# Altium schematic sheet Communication.SchDoc
size A4; SheetNumber: 2; SheetTotal: 4
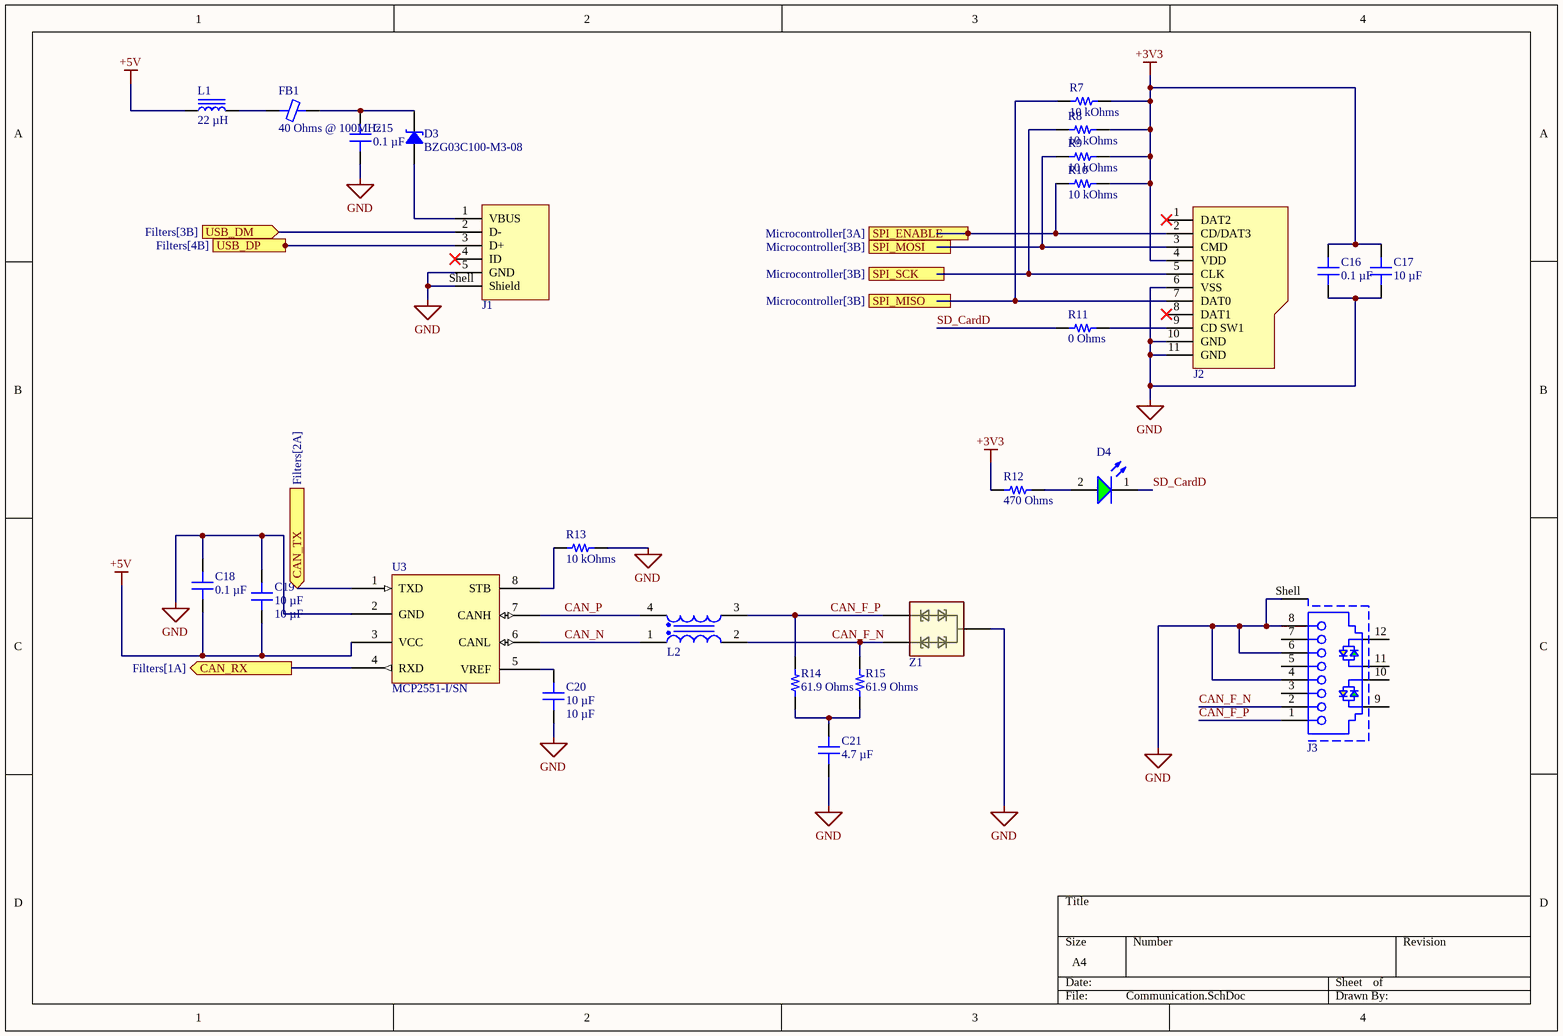
[diagram p0: Communication.SchDoc]

## Parts
C15  0.1 µF  [CAP 0805_2012]
C16  0.1 µF  [CAP 0805_2012]
C17  10 µF  [CAP 0805_2012]
C18  0.1 µF  [CAP 0805_2012]
C19  10 µF  [CAP 0805_2012]
C20  10 µF  [CAP 0805_2012]
C21  4.7 µF  [CAP 0805_2012]
D3  BZG03C100-M3-08  [DO214AC SMA]
D4  Green, 3.2V, 140°  [WL-SMCW_0805_150080xx75000]  (value not drawn)
FB1  40 Ohms @ 100MHz  [FER 0805_2012]
J1  629105150521  [629105150521]  (value not drawn)
J2  693071030811  [693071030811]  (value not drawn)
J3  615008142121  [615008142121]  (value not drawn)
L1  22 µH  [IND 0806_2016]
L2  5000Ohm  [WE-CNSW_1812]  (value not drawn)
R7  10 kOhms  [RES 0805_2012]
R8  10 kOhms  [RES 0805_2012]
R9  10 kOhms  [RES 0805_2012]
R10  10 kOhms  [RES 0805_2012]
R11  0 Ohms  [RES 0805_2012]
R12  470 Ohms  [RES 0805_2012]
R13  10 kOhms  [RES 0805_2012]
R14  61.9 Ohms  [RES 0805_2012]
R15  61.9 Ohms  [RES 0805_2012]
U3  Supplier Part Number 1: MCP2551-I/SN  [MCP2551T-I/SN]  (hidden comment: MCP2551)
Z1  PESD2CAN,215  [SOT95P230X110-3N]  (value not drawn)

## Ports
CAN_RX (out, see Filters[1A]), CAN_TX (in, see Filters[2A]), SPI_ENABLE (in, see Microcontroller[3A]), SPI_MISO (out, see Microcontroller[3B]), SPI_MOSI (in, see Microcontroller[3B]), SPI_SCK (in, see Microcontroller[3B]), USB_DM (in, see Filters[3B]), USB_DP (out, see Filters[4B])

## Nets
+3V3: C16.2 C17.2 J2.4(VDD) R7.2 R8.2 R9.2 R10.2 R12.1
+5V: C18.2 C19.1 L1.1 U3.3(VCC)
GND: C15.1 C16.1 C17.1 C18.1 C19.2 C20.1 C21.1 J1.5(GND) J1.Shell(Shield) J2.6(VSS) J2.10(GND) J2.11(GND) J3.4 J3.6 J3.8 J3.Shell R13.2 U3.2(GND) Z1.3
CAN_F_N: J3.2 L2.2 R15.2 Z1.2
CAN_F_P: J3.1 L2.3 R14.2 Z1.1
CAN_N: L2.1 U3.6(CANL)
CAN_P: L2.4 U3.7(CANH)
CAN_RX: U3.4(RXD) ; port CAN_RX
CAN_TX: U3.1(TXD) ; port CAN_TX
SD_CardD: D4.1(K) R11.1
SPI_ENABLE: J2.2(CD/DAT3) R10.1 ; port SPI_ENABLE
SPI_MISO: J2.7(DAT0) R7.1 ; port SPI_MISO
SPI_MOSI: J2.3(CMD) R9.1 ; port SPI_MOSI
SPI_SCK: J2.5(CLK) R8.1 ; port SPI_SCK
USB_DM: J1.2(D-) ; port USB_DM
USB_DP: J1.3(D+) ; port USB_DP
NetC15_2: C15.2 D3.2 FB1.2
NetC20_2: C20.2 U3.5(VREF)
NetC21_2: C21.2 R14.1 R15.1
NetD3_1: D3.1 J1.1(VBUS)
NetD4_2: D4.2(A) R12.2
NetFB1_1: FB1.1 L1.2
NetJ2_9: J2.9(CD_SW1) R11.2
NetR13_1: R13.1 U3.8(STB)

Not connected (* = marked no-connect by the designer): J1 4(ID)*; J2 1(DAT2)* 8(DAT1)*; J3 3 5 7 9 10 11 12

## Library data of the parts
C15 C16 C18 = CC0805MRX7R9BB104: CAP CER 0.1UF 50V X7R 0805; manufacturer: Yageo; Tolerance: ±20%; Part Number: CC0805MRX7R9BB104; Value: 0.1 µF; Applications: General Purpose; Capacitance: 0.1 µF; componentlink1description: Datasheet; componentlink1url: https://www.yageo.com/upload/media/product/productsearch/datasheet/mlcc/UPY-GPHC_X7R_6.3V-to-50V_18.pdf; componentlink2description: DigiKey Link; componentlink2url: https://www.digikey.com/en/products/detail/yageo/CC0805MRX7R9BB104/5884281; Device Package: 0805 (2012 Metric); lastupdated: 9.02.2024 20:16:09; Lifecycle Status: Active; Minimum Order: 1; Mounting Type: Surface Mount, MLCC; Operating Temperature: -55°C ~ 125°C; Package / Case: 0805 (2012 Metric); packaging: TapeAndReel; partid: 2475; Part Status: Active; price: 0.01; series: CC; Size / Dimension: 0.079" L x 0.049" W (2.00mm x 1.25mm); Supplier 1: DigiKey; Supplier Part Number 1: 311-4351-1-ND; Temperature Coefficient: X7R; Thickness (Max): 0.037" (0.95mm); Voltage - Rated: 50V
C17 = CL21Y106KPQVPNE: CAP CER 10UF 10V X7S 0805; manufacturer: Samsung Electro-Mechanics; Tolerance: ±10%; Part Number: CL21Y106KPQVPNE; Value: 10 µF; Applications: Automotive; Capacitance: 10 µF; componentlink1description: Datasheet; componentlink1url: http://www.samsungsem.com/kr/support/product-search/mlcc/CL21Y106KPQVPNE.jsp; componentlink2description: DigiKey Link; componentlink2url: https://www.digikey.com/en/products/detail/samsung-electro-mechanics/CL21Y106KPQVPNE/5961169; Device Package: 0805 (2012 Metric); lastupdated: 9.02.2024 20:16:08; Lifecycle Status: Active; Minimum Order: 1; Mounting Type: Surface Mount, MLCC; Operating Temperature: -55°C ~ 125°C; Package / Case: 0805 (2012 Metric); packaging: TapeAndReel; partid: 2979; Part Status: Active; price: 0.06; Ratings: AEC-Q200; series: CL; Size / Dimension: 0.079" L x 0.049" W (2.00mm x 1.25mm); Supplier 1: DigiKey; Supplier Part Number 1: 1276-6685-1-ND; Temperature Coefficient: X7S; Thickness (Max): 0.055" (1.40mm); Voltage - Rated: 10V
C19 C20 = CL21Y106KPQVPNE: CAP CER 10UF 10V X7S 0805; Part Number: CL21Y106KPQVPNE; Value: 10 µF
C21 = CL21B475KAFNNNE: CAP CER 4.7UF 25V X7R 0805; manufacturer: Samsung Electro-Mechanics; Tolerance: ±10%; Part Number: CL21B475KAFNNNE; Value: 4.7 µF; Applications: General Purpose; Capacitance: 4.7 µF; componentlink1description: Datasheet; componentlink1url: http://www.samsungsem.com/kr/support/product-search/mlcc/CL21B475KAFNNNE.jsp; componentlink2description: DigiKey Link; componentlink2url: https://www.digikey.com/en/products/detail/samsung-electro-mechanics/CL21B475KAFNNNE/3888627; Device Package: 0805 (2012 Metric); lastupdated: 9.02.2024 20:16:07; Lifecycle Status: Active; Minimum Order: 1; Mounting Type: Surface Mount, MLCC; Operating Temperature: -55°C ~ 125°C; Package / Case: 0805 (2012 Metric); packaging: TapeAndReel; partid: 3072; Part Status: Active; price: 0.08; series: CL; Size / Dimension: 0.079" L x 0.049" W (2.00mm x 1.25mm); Supplier 1: DigiKey; Supplier Part Number 1: 1276-2969-1-ND; Temperature Coefficient: X7R; Thickness (Max): 0.053" (1.35mm); Voltage - Rated: 25V
D3 = BZG03C100-M3-08: DIODE ZENER 100V 1.25W DO214AC; Manufacturer: Vishay Semiconductor Diodes Division; Current - Reverse Leakage @ Vr: 1µA @ 75V; Impedance (Max) (Zzt): 200 Ohms; Tolerance: ±6%; Voltage - Forward (Vf) (Max) @ If: 1.2V @ 500mA; Part Number: BZG03C100-M3-08; ComponentLink1Description: Datasheet; ComponentLink1URL: http://www.vishay.com/docs/86138/bzg03c-m-series.pdf; ComponentLink2Description: DigiKey Link; ComponentLink2URL: http://digikey.com/product-detail/en/vishay-semiconductor-diodes-division/BZG03C100-M3-08/BZG03C100-M3-08GICT-ND/8554991; LastUpdated: 3.06.2024 19:55:28; Lifecycle Status: Active; Minimum Order: 1; Mounting Type: Surface Mount; Operating Temperature: 150°C (TJ); Package / Case: DO-214AC, SMA; Packaging: TapeAndReel; PartId: 1296; Part Status: Active; Power - Max: 1.25W; Price: 0.18; Series: BZG03C-M; Supplier 1: DigiKey; Supplier Part Number 1: BZG03C100-M3-08GICT-ND; Supplier Device Package: DO-214AC (SMA); Voltage - Zener (Nom) (Vz): 100V
D4 = 150080GS75000: WL-SMCW Mono-color Chip LED Waterclear, size 0805, Green, 3.2V, 140°; Manufacturer: Wurth Elektronik; Case/Size Code: 0805; Chip Technology: InGaN; Dominant Wavelength: 525nm; Luminous Intensity: 450mcd; Peak Wavelength: 515nm; Manufacturer Part Number: 150080GS75000; Category: Signal LEDs; Match Code: WL-SMCW; ComponentLink1Description: Website Link; ComponentLink1URL: https://www.we-online.com/redexpert/article/150080GS75000?ad; ComponentLink2Description: Datasheet Link; ComponentLink2URL: https://www.we-online.com/redexpert/spec/150080GS75000?ad; Mount: Surface Mount; Operating Temperature Max: 85°C; Operating Temperature Min: -40°C; Packaging: Tape and Reel; Length: 2mm; Width: 1.25mm; Height: 0.7mm; Emitting Color: Green; Forward Voltage: 3.2V; Viewing Angle: 140°
FB1 = ILBB0805ER400V: FERRITE BEAD 40 OHM 0805 1LN; Manufacturer: Vishay Dale; Current Rating (Max): 300mA; DC Resistance (DCR) (Max): 150mOhm; Number of Lines: 1; Part Number: ILBB0805ER400V; ComponentLink1Description: Datasheet; ComponentLink1URL: https://www.vishay.com/docs/34025/ilbb0805.pdf; ComponentLink2Description: DigiKey Link; ComponentLink2URL: http://digikey.com/product-detail/en/vishay-dale/ILBB0805ER400V/ILBB0805ER400V-ND/2574916; Height (Max): 0.043" (1.10mm); Impedance @ Frequency: 40 Ohms @ 100MHz; LastUpdated: 30.08.2020 20:58:50; Lifecycle Status: Active; Minimum Order: 8000; Mounting Type: Surface Mount; Package / Case: 0805 (2012 Metric); Packaging: TapeAndReel; PartId: 2358; Price: 0.02; Series: ILBB-0805; Size / Dimension: 0.079" L x 0.049" W (2.00mm x 1.25mm); Supplier 1: DigiKey; Supplier Part Number 1: ILBB0805ER400V-ND; Value: 40 Ohms @ 100MHz
J1 = 629105150521: WR-COM Micro USB 2.0 SMT Type B Horizontal 5 Contacts High Current; Manufacturer: Wurth Elektronik; Match Code: WR-USB; Gender: Receptacle; Interface Type: Type B; Number of Ports: 1; Rated Current: 3A; Working Voltage: 30V (AC); Manufacturer Part Number: 629105150521; Category: Input/Output Connectors; ComponentLink1Description: Website Link; ComponentLink1URL: https://www.we-online.com/redexpert/article/629105150521?ad; ComponentLink2Description: Datasheet Link; ComponentLink2URL: https://www.we-online.com/redexpert/spec/629105150521?ad; Mount: Surface Mount; Operating Temperature Max: 85°C; Operating Temperature Min: -40°C; Packaging: Tape and Reel; Application: Micro USB 2.0; Number of Pins: 5; Orientation: Horizontal
J2 = 693071030811: WR-CRD Micro SD Card Connector Push & Push; Manufacturer: Wurth Elektronik; Contact Resistance: 100mOhm; Gender: Socket; Rated Current: 0.5A; Working Voltage: 30VAC; Withstanding Voltage: 500VAC; Manufacturer Part Number: 693071030811; Category: Input/Output Connectors; Match Code: WR-CRD; ComponentLink1Description: Website Link; ComponentLink1URL: https://www.we-online.com/redexpert/article/693071030811?ad; ComponentLink2Description: Datasheet Link; ComponentLink2URL: https://www.we-online.com/redexpert/spec/693071030811?ad; Mount: Surface Mount; Operating Temperature Max: 85°C; Operating Temperature Min: -25°C; Packaging: Tape and Reel; Number of Pins: 8; Type: Push & Push
J3 = 615008142121: WR-MJ Modular Jack THT Horizontal Shielded 8P8C Tab Up; Manufacturer: Wurth Elektronik; Contact Resistance: 20mOhm; Insulation Resistance: 500MOhm; LED: Bipolar Y/G; Number of Ports: 1; Rated Current: 1.5A; Shielding: Yes; Working Voltage: 120VAC; Withstanding Voltage: 1000VAC; Manufacturer Part Number: 615008142121; Category: Input/Output Connectors; Match Code: WR-MJ; ComponentLink1Description: Website Link; ComponentLink1URL: https://www.we-online.com/redexpert/article/615008142121?ad; ComponentLink2Description: Datasheet Link; ComponentLink2URL: https://www.we-online.com/redexpert/spec/615008142121?ad; Mount: Through Hole; Operating Temperature Max: 85°C; Operating Temperature Min: -40°C; Packaging: Tray; Number of Pins: 8P8C; Orientation: Horizontal
L1 = LSQPB201616T220M: FIXED IND 22UH 310MA 1 OHM SMD; Manufacturer: Taiyo Yuden; DC Resistance (DCR): 1.3Ohm Max; Frequency - Self Resonant: 24MHz; Inductance Frequency - Test: 100 kHz; Material - Core: Ferrite; Shielding: Unshielded; Tolerance: ±20%; Type: Wirewound; Part Number: LSQPB201616T220M; ComponentLink1Description: Datasheet; ComponentLink1URL: https://mm.digikey.com/Volume0/opasdata/d220001/medias/docus/6025/LSQPB201616T220M_SS.pdf; ComponentLink2Description: DigiKey Link; ComponentLink2URL: https://www.digikey.com/en/products/detail/taiyo-yuden/LSQPB201616T220M/16660797; Current Rating (Amps): 310 mA; Device Package: 0806 (2016 Metric); Height - Seated (Max): 0.071" (1.80mm); Inductance: 22 µH; LastUpdated: 3.06.2024 20:13:57; Lifecycle Status: Active; Minimum Order: 1; Mounting Type: Surface Mount; Operating Temperature: -40°C ~ 105°C; Package / Case: 0806 (2016 Metric); Packaging: TapeAndReel; PartId: 7265; Price: 0.09; Series: LSQP; Size / Dimension: 0.079" L x 0.063" W (2.00mm x 1.60mm); Supplier 1: DigiKey; Supplier Part Number 1: 587-LSQPB201616T220MCT-ND; Supplier Device Package: 0806; Value: 22 µH
L2 = 744235101: WE-CNSW SMT Common Mode Line Filter, size 1812, 5000Ohm, 100uH, 60V; Manufacturer: Wurth Elektronik; Case/Size Code: 1812; DC Resistance Max: 2Ohm; Insulation Test Voltage (AC): 125V; Rated Current: 0.15A; Winding Style: bifiliar; Manufacturer Part Number: 744235101; Category: Common Mode Chokes; Match Code: WE-CNSW; ComponentLink1Description: Website Link; ComponentLink1URL: https://www.we-online.com/redexpert/article/744235101?ad; ComponentLink2Description: Datasheet Link; ComponentLink2URL: https://www.we-online.com/redexpert/spec/744235101?ad; Mount: Surface Mount; Operating Temperature Max: 125°C; Operating Temperature Min: -40°C; Packaging: Tape and Reel; Length: 4.5mm; Width: 3.2mm; Height: 2.8mm; Impedance @10MHz: 5000Ohm; Inductance: 100uH; Rated Voltage: 60V
R7-R10 R13 = 2176093-5: RES SMD 10K OHM 0.1% 1/4W 0805; Manufacturer: TE Connectivity Passive Product; Power (Watts): 0.25W, 1/4W; Temperature Coefficient: ±25ppm/°C; Part Number: 2176093-5; Value: 10 kOhms; ComponentLink1Description: Datasheet; ComponentLink1URL: https://www.te.com/commerce/DocumentDelivery/DDEController?Action=srchrtrv&DocNm=1773272&DocType=DS&DocLang=English; ComponentLink2Description: DigiKey Link; ComponentLink2URL: https://www.digikey.com/en/products/detail/te-connectivity-passive-product/2176093-5/4034107; Composition: Thin Film; Device Package: 0805 (2012 Metric); Height - Seated (Max): 0.026" (0.65mm); LastUpdated: 8.02.2024 21:02:35; Lifecycle Status: Active; Minimum Order: 1; Number of Terminations: 2; Operating Temperature: -55°C ~ 155°C; Package / Case: 0805 (2012 Metric); Packaging: TapeAndReel; PartId: 28478; Part Status: Active; Price: 0.14; Resistance: 10 kOhms; Series: RP73P, Holsworthy; Size / Dimension: 0.079" L x 0.049" W (2.00mm x 1.25mm); Supplier 1: DigiKey; Supplier Part Number 1: A110639CT-ND; Supplier Device Package: 0805; Tolerance: ±0.1%
R11 = 5107: RES 0 OHM JUMPER 0805; Part Number: 5107; Manufacturer: Keystone Electronics; Power (Watts): 0.5W, 1/2W; Value: 0 Ohms; ComponentLink1Description: Datasheet; ComponentLink1URL: http://www.keyelco.com/product-pdf.cfm?p=14350; ComponentLink2Description: DigiKey Link; ComponentLink2URL: https://www.digikey.com/en/products/detail/keystone-electronics/5107/7942981; Composition: Metal Element; Device Package: 0805 (2012 Metric); Height - Seated (Max): 0.033" (0.84mm); LastUpdated: 8.02.2024 21:01:23; Lifecycle Status: Active; Minimum Order: 1; Number of Terminations: 2; Package / Case: 0805 (2012 Metric); Packaging: TapeAndReel; PartId: 45276; Part Status: Active; Price: 0.16; Resistance: 0 Ohms; Series: -; Size / Dimension: 0.079" L x 0.049" W (2.00mm x 1.25mm); Supplier 1: DigiKey; Supplier Part Number 1: 36-5107CT-ND; Supplier Device Package: 0805; Tolerance: Jumper
R12 = 3430A2F470RTDF: 3430 A2 1% 470R 100PPM 1K RL; Manufacturer: TE Connectivity Passive Product; Power (Watts): 1W; Temperature Coefficient: ±100ppm/°C; Part Number: 3430A2F470RTDF; Value: 470 Ohms; ComponentLink2Description: DigiKey Link; ComponentLink2URL: https://www.digikey.com/en/products/detail/te-connectivity-passive-product/3430A2F470RTDF/17763718; Composition: Thick Film; Device Package: 0805 (2012 Metric); Features: Automotive AEC-Q200; Height - Seated (Max): 0.026" (0.65mm); LastUpdated: 8.02.2024 21:00:03; Lifecycle Status: Active; Minimum Order: 1; Number of Terminations: 2; Operating Temperature: -55°C ~ 155°C; Package / Case: 0805 (2012 Metric); Packaging: TapeAndReel; PartId: 77780; Part Status: Active; Price: 0.02; Ratings: AEC-Q200; Resistance: 470 Ohms; Series: 3430; Size / Dimension: 0.049" L x 0.079" W (1.25mm x 2.00mm); Supplier 1: DigiKey; Supplier Part Number 1: 1712-3430A2F470RTDFCT-ND; Supplier Device Package: 0508; Tolerance: ±1%
R14 R15 = 2176091-4: RES SMD 61.9 OHM 0.1% 1/4W 0805; Manufacturer: TE Connectivity Passive Product; Power (Watts): 0.25W, 1/4W; Temperature Coefficient: ±25ppm/°C; Part Number: 2176091-4; Value: 61.9 Ohms; ComponentLink1Description: Datasheet; ComponentLink1URL: https://www.te.com/commerce/DocumentDelivery/DDEController?Action=srchrtrv&DocNm=1773272&DocType=DS&DocLang=English; ComponentLink2Description: DigiKey Link; ComponentLink2URL: https://www.digikey.com/en/products/detail/te-connectivity-passive-product/2176091-4/4033895; Composition: Thin Film; Device Package: 0805 (2012 Metric); Height - Seated (Max): 0.026" (0.65mm); LastUpdated: 8.02.2024 21:01:14; Lifecycle Status: Active; Minimum Order: 1; Number of Terminations: 2; Operating Temperature: -55°C ~ 155°C; Package / Case: 0805 (2012 Metric); Packaging: TapeAndReel; PartId: 46762; Part Status: Active; Price: 0.14; Resistance: 61.9 Ohms; Series: RP73P, Holsworthy; Size / Dimension: 0.079" L x 0.049" W (2.00mm x 1.25mm); Supplier 1: DigiKey; Supplier Part Number 1: A110427CT-ND; Supplier Device Package: 0805; Tolerance: ±0.1%
U3 = MCP2551: MCP2551 CAN Transreciever 8Mbit/sn; Virtual Junction Temperature (Tvj): -40°C ~ 150°C; VCANH-VCANL: -40V ~ 40V; Transreciever Hysteresis: 50mV; Differential Reciever Hysteresis: 100mV; Datasheet: https://www.nxp.com/docs/en/data-sheet/TJA1462.pdf; Operating Temperature: -40°C ~ 125°C; Supplier 1: Arrow Electronics
Z1 = PESD2CAN,215: Zener Diode; Manufacturer_Name: Nexperia; Datasheet Link: http://de.rs-online.com/webdocs/0b4d/0900766b80b4dbb6.pdf; Height: 1.1mm; Manufacturer_Part_Number: PESD2CAN,215; Mouser Part Number: 771-PESD2CAN-T/R; Mouser Price/Stock: https://www.mouser.com/Search/Refine.aspx?Keyword=771-PESD2CAN-T%2FR; RS Part Number: 0508462; RS Price/Stock: http://uk.rs-online.com/web/p/products/0508462